# Altium project ST-LinkV2.PrjPcb
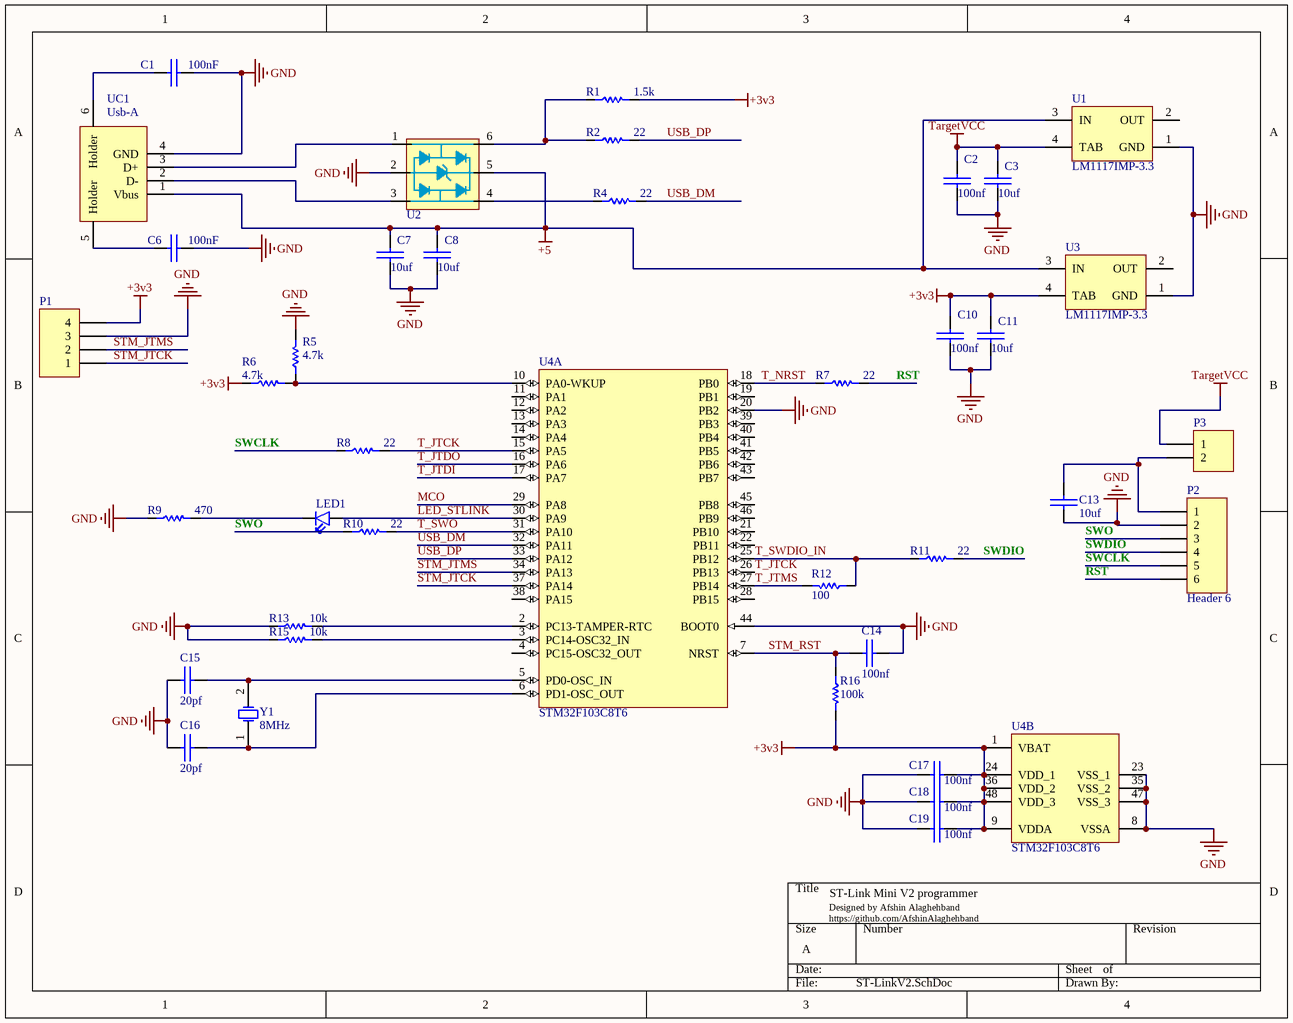
[diagram p0: ST-LinkV2.SchDoc]
1 sheet, 39 parts. Net scope: global (net labels, ports and power ports of the same name join across sheets).
Board file: ST-LinkV2.PcbDoc

## Sheet ST-LinkV2.SchDoc
size A

### Parts
C1  100nF  [SMD_CAP_0805]
C2  100nf  [SMD_CAP_0805]
C3  10uf  [SMD_CAP_0805]
C6  100nF  [SMD_CAP_0805]
C7  10uf  [SMD_CAP_0805]
C8  10uf  [SMD_CAP_0805]
C10  100nf  [SMD_CAP_0805]
C11  10uf  [SMD_CAP_0805]
C13  10uf  [SMD_CAP_0805]
C14  100nf  [SMD_CAP_0805]
C15  20pf  [SMD_CAP_0805]
C16  20pf  [SMD_CAP_0805]
C17  100nf  [SMD_CAP_0805]
C18  100nf  [SMD_CAP_0805]
C19  100nf  [SMD_CAP_0805]
LED1  LED  [LED0805]  (value not drawn)
P1  Header 4  [HDR1X4]  (value not drawn)
P2  Header 6  [HDR1X6]
P3  Header 2  [HDR1X2]  (value not drawn)
R1  1.5k  [RES 0805 (2012X06L)]
R2  22  [RES 0805 (2012X06L)]
R4  22  [RES 0805 (2012X06L)]
R5  4.7k  [RES 0805 (2012X06L)]
R6  4.7k  [RES 0805 (2012X06L)]
R7  22  [RES 0805 (2012X06L)]
R8  22  [RES 0805 (2012X06L)]
R9  470  [RES 0805 (2012X06L)]
R10  22  [RES 0805 (2012X06L)]
R11  22  [RES 0805 (2012X06L)]
R12  100  [RES 0805 (2012X06L)]
R13  10k  [RES 0805 (2012X06L)]
R15  10k  [RES 0805 (2012X06L)]
R16  100k  [RES 0805 (2012X06L)]
U1  LM1117IMP-3.3  [MP04A_N]
U2  USBLC6-2  [USBLC6-2]  (value not drawn)
U3  LM1117IMP-3.3  [MP04A_N]
U4  STM32F103C8T6  [STM-LQFP48_N]  (parts A,B of 2)
UC1  Usb-A  [USB A Connector]
Y1  8MHz  [XTAL Small]

### Nets
+3v3: C10.2(-) C11.2(-) C17.1(+) C18.1(+) C19.1(+) P1.4 R1.2 R6.1 R16.2 U3.4(TAB) U4.1(VBAT) U4.9(VDDA) U4.24(VDD_1) U4.36(VDD_2) U4.48(VDD_3)
+5: C7.2(-) C8.2(-) U1.3(IN) U2.5 U3.3(IN) UC1.1(Vbus)
GND: C1.2(-) C2.1(+) C3.1(+) C6.2(-) C7.1(+) C8.1(+) C10.1(+) C11.1(+) C13.1(+) C14.2(-) C15.1(+) C16.1(+) C17.2(-) C18.2(-) C19.2(-) P1.3 P2.2 R5.2 R9.1 R13.1 R15.1 U1.1(GND) U2.2 U3.1(GND) U4.8(VSSA) U4.20(PB2) U4.23(VSS_1) U4.35(VSS_2) U4.44(BOOT0) U4.47(VSS_3) UC1.4(GND)
TargetVCC: C2.2(-) C3.2(-) P3.1 U1.4(TAB)
LED_STLINK: LED1.1(A) U4.30(PA9)
MCO: U4.29(PA8)
RST: P2.6 R7.2
STM_JTCK: P1.1 U4.37(PA14)
STM_JTMS: P1.2 U4.34(PA13)
STM_RST: C14.1(+) R16.1 U4.7(NRST)
SWCLK: P2.5 R8.1
SWDIO: P2.4 R11.2
SWO: P2.3 R10.1
T_JTCK: R8.2 U4.15(PA5) U4.26(PB13)
T_JTDI: U4.17(PA7)
T_JTDO: U4.16(PA6)
T_JTMS: R12.2 U4.27(PB14)
T_NRST: R7.1 U4.18(PB0)
T_SWDIO_IN: R11.1 R12.1 U4.25(PB12)
T_SWO: R10.2 U4.31(PA10)
USB_DM: R4.2 U4.32(PA11)
USB_DP: R2.2 U4.33(PA12)
NetC1_1: C1.1(+) UC1.6(Holder)
NetC6_1: C6.1(+) UC1.5(Holder)
NetC13_2: C13.2(-) P2.1 P3.2
NetC15_2: C15.2(-) U4.5(PD0-OSC_IN) Y1.2(OSC2)
NetC16_2: C16.2(-) U4.6(PD1-OSC_OUT) Y1.1(OSC1)
NetLED1_2: LED1.2(K) R9.2
NetR1_1: R1.1 R2.1 U2.6(IO)
NetR4_1: R4.1 U2.4
NetR5_1: R5.1 R6.2 U4.10(PA0-WKUP)
NetR13_2: R13.2 U4.2(PC13-TAMPER-RTC)
NetR15_2: R15.2 U4.3(PC14-OSC32_IN)
NetU2_1: U2.1 UC1.3(D+)
NetU2_3: U2.3 UC1.2(D-)

Not connected (* = marked no-connect by the designer): U1 2(OUT); U3 2(OUT); U4 4(PC15-OSC32_OUT) 11(PA1) 12(PA2) 13(PA3) 14(PA4) 19(PB1) 21(PB10) 22(PB11) 28(PB15) 38(PA15) 39(PB3) 40(PB4) 41(PB5) 42(PB6) 43(PB7) 45(PB8) 46(PB9)

### Notes on the sheet
- ST-Link Mini V2 programmer
- Designed by Afshin Alaghehband https://github.com/AfshinAlaghehband

### Library data of the parts
C1-C3 C6-C8 C10 C11 C13-C19 = Cap-Bipolar: Bipolar Capacitor; Voltage: 100V; Designer: Saeid Jorablo; Organazation: ControTec; Adding Date: 1387/12/20
  C1 C6: Value: 100nF
  C2 C10 C14 C17-C19: Value: 100nf
  C3 C7 C8 C11 C13: Value: 10uf
  C15 C16: Value: 20pf
LED1 = LED: 0805; Designer :: Razi Research Team Of Mashhad - Hamed Jafarzadeh
P1 = Header 4: Header, 4-Pin; LatestRevisionDate: 17-Jul-2002; LatestRevisionNote: Re-released for DXP Platform.; Publisher: Altium Limited
P2 = Header 6: Header, 6-Pin; LatestRevisionDate: 17-Jul-2002; LatestRevisionNote: Re-released for DXP Platform.; Publisher: Altium Limited
P3 = Header 2: Header, 2-Pin; LatestRevisionDate: 17-Jul-2002; LatestRevisionNote: Re-released for DXP Platform.; Publisher: Altium Limited
R1 R2 R4-R13 R15 R16 = Resistor: Tolerance: 5%; Power: 1/8 W
  R1: Value: 1.5k
  R2 R4 R7 R8 R10 R11: Value: 22
  R5 R6: Value: 4.7k
  R9: Value: 470
  R12: Value: 100
  R13 R15: Value: 10k
  R16: Value: 100k
U1 U3 = LM1117IMP-x.x: 3.3 Volt, 800mA; Manufacturer: National Semiconductor; PackageTopMarking: XYTT*N05B; PowerWise: N; CompType: LDO IC; Published: 4-Dec-2008; DatasheetVersion: Apr-2006; PackageVersion: revB, Apr-2003; PackageReference: MP04A; Publisher: Altium Limited; PackageDescription: Molded SOT-223, 6.50 x 3.56 x 1.6mm Body, 4 Lead, 2.3mm Pitch; Supplier 1: Farnell; Supplier Part Number 1: 7614123; PartNumber: LM1117IMP-3.3; RoHS: N; PinCount: 4; Code_JEDEC: TO-261-AA; Code_IPC: SOT223-4; ComponentLink1Description: LM1117 Datasheet; ComponentLink1URL: http://www.national.com/ds/LM/LM1117.pdf; ComponentLink2Description: LM1117 Web Page; ComponentLink2URL: http://www.national.com/pf/LM/LM1117.html; ComponentLink3Description: MP04A Package Page; ComponentLink3URL: http://www.national.com/packaging/folders/mp04a.html
U2 = USBLC6-2: Very low capacitance ESD protection;2 data lines protection,Very low capacitance: 3.5 pF max,Protects VBU; Designer: Hamed Jafarzadeh
U4 = STM32F103C8T6: ARM Cortex-M3 32-bit MCU, 64 KB Flash, 20 KB Internal RAM, 37 I/Os, 48-pin LQFP, -40 to 85 degC, Tray; A/D Converter: 2x12-bit (10 Channel); FLASH Size (Prog) (kB): 64; I/Os (High Current): 37; Internal RAM Size (kB): 20; Operating Frequency(F) (Processor speed) (MHz): 72; Supply Voltage(Vcc) min (V): 2; DatasheetVersion: Rev. 16; PackageVersion: Rev. 6, 06/2013; PackageReference: LQFP48; PackageDescription: 48-Pin Low Profile Quad Flat Package, 7 x 7 mm Body, 0.5 mm Pitch; Supplier 1: Digi-Key; Supplier Part Number 1: 497-6063-ND; Supplier 2: Farnell; Supplier Part Number 2: 1447637; Supplier 3: Newark; Supplier Part Number 3: 59M2182; Supplier 4: Newark; Supplier Part Number 4: 57P1222; Supplier 5: Mouser; Supplier Part Number 5: 511-STM32F103C8T6; Core: ARM Cortex-M3; Packing: Tray; Mounting Technology: Surface Mount; PartNumber: STM32F103C8T6; ComponentLink1Description: Manufacturer URL; ComponentLink1URL: http://www.st.com/web/en/home.html; ComponentLink2Description: Datasheet; ComponentLink2URL: http://www.st.com/st-web-ui/static/active/en/resource/technical/document/datasheet/CD00161566.pdf; ComponentLink3Description: Package Specification; ComponentLink3URL: http://www.st.com/st-web-ui/static/active/en/resource/technical/document/datasheet/DM00058181.pdf
UC1 = USB: Designer :: HamedJafarzadeh
Y1 = XTAL: XTAL Crystal; Company: E.P.I.L; Design Date: 11/04/2011; Value: 8MHz